# Altium schematic sheet MCU_main.SchDoc
size A4; SheetNumber: 4; SheetTotal: 5
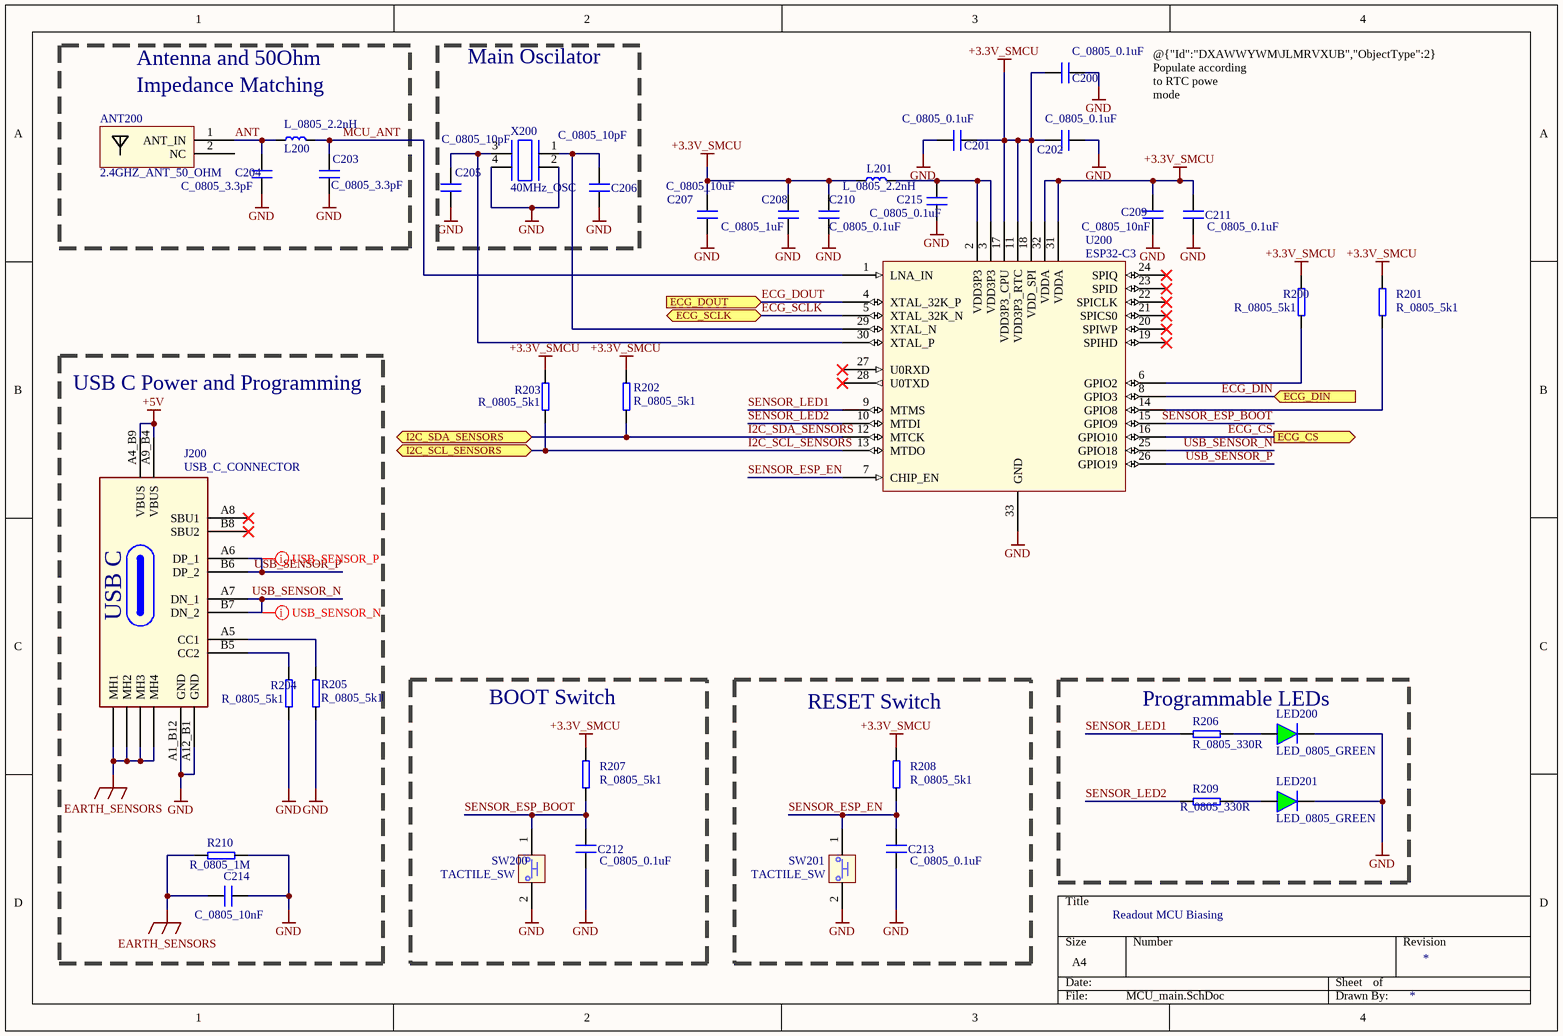
[diagram p0: MCU_main.SchDoc]

## Parts
ANT200  2.4GHZ_ANT_50_OHM  [Chip2PinSM127P600-8N]
C200  C_0805_0.1uF  [CAP_0805]
C201  C_0805_0.1uF  [CAP_0805]
C202  C_0805_0.1uF  [CAP_0805]
C203  C_0805_3.3pF  [CAP_0805]
C204  C_0805_3.3pF  [CAP_0805]
C205  C_0805_10pF  [CAP_0805]
C206  C_0805_10pF  [CAP_0805]
C207  C_0805_10uF  [CAP_0805]
C208  C_0805_1uF  [CAP_0805]
C209  C_0805_10nF  [CAP_0805]
C210  C_0805_0.1uF  [CAP_0805]
C211  C_0805_0.1uF  [CAP_0805]
C212  C_0805_0.1uF  [CAP_0805]
C213  C_0805_0.1uF  [CAP_0805]
C214  C_0805_10nF  [CAP_0805]
C215  C_0805_0.1uF  [CAP_0805]
J200  USB_C_CONNECTOR  [USB_C_CONNECTOR-Footprint-1]
L200  L_0805_2.2nH  [L_0805]
L201  L_0805_2.2nH  [L_0805]
LED200  LED_0805_GREEN  [LED_0806]
LED201  LED_0805_GREEN  [LED_0806]
R200  R_0805_5k1  [0805_RES]
R201  R_0805_5k1  [0805_RES]
R202  R_0805_5k1  [0805_RES]
R203  R_0805_5k1  [0805_RES]
R204  R_0805_5k1  [0805_RES]
R205  R_0805_5k1  [0805_RES]
R206  R_0805_330R  [0805_RES]
R207  R_0805_5k1  [0805_RES]
R208  R_0805_5k1  [0805_RES]
R209  R_0805_330R  [0805_RES]
R210  R_0805_1M  [0805_RES]
SW200  TACTILE_SW  [TACTILE_SW-Footprint-1]
SW201  TACTILE_SW  [TACTILE_SW-Footprint-1]
U200  ESP32-C3  [QFN127P600-8N]
X200  40MHz_OSC  [40MHz_OSC-Footprint-1]

## Blocks framed on the sheet
Main Oscilator: C205 C206 X200
USB C Power and Programming: C214 J200 R204 R205 R210
BOOT Switch: C212 R207 SW200
RESET Switch: C213 R208 SW201
Programmable LEDs: LED200 LED201 R206 R209

## Ports
ECG_CS (out, see Sensors_Power_Characterisation_Board[2B], Sensors[3D]), ECG_DIN (in, see Sensors_Power_Characterisation_Board[2B], Sensors[3D]), ECG_DOUT (in, see Sensors_Power_Characterisation_Board[2B], Sensors[3D]), ECG_SCLK (bidir, see Sensors_Power_Characterisation_Board[2B], Sensors[3D]), I2C_SCL_SENSORS (bidir, see Sensors_Power_Characterisation_Board[2B]), I2C_SDA_SENSORS (bidir, see Sensors_Power_Characterisation_Board[2B])

## Nets
+3.3V_SMCU: C200.1 C201.2 C202.1 C207.2 C208.2 C209.2 C210.1 C211.2 L201.1 R200.1 R201.1 R202.1 R203.1 R207.1 R208.1 U200.11(VDD3P3_RTC) U200.17(VDD3P3_CPU) U200.18(VDD_SPI) U200.31(VDDA) U200.32(VDDA)
+5V: J200.A4_B9(VBUS) J200.A9_B4(VBUS)
EARTH_SENSORS: C214.1 J200.MH1 J200.MH2 J200.MH3 J200.MH4 R210.2
GND: C200.2 C201.1 C202.2 C203.1 C204.1 C205.1 C206.1 C207.1 C208.1 C209.1 C210.2 C211.1 C212.1 C213.1 C214.2 C215.2 J200.A1_B12(GND) J200.A12_B1(GND) LED200.1 LED201.1 R204.2 R205.2 R210.1 SW200.2 SW201.2 U200.33(GND) X200.2 X200.4
ANT: ANT200.1(ANT_IN) C204.2 L200.1
ECG_CS: U200.16(GPIO10) ; port ECG_CS
ECG_DIN: U200.8(GPIO3) ; port ECG_DIN
ECG_DOUT: U200.4(XTAL_32K_P) ; port ECG_DOUT
ECG_SCLK: U200.5(XTAL_32K_N) ; port ECG_SCLK
I2C_SCL_SENSORS: R203.2 U200.13(MTDO) ; port I2C_SCL_SENSORS
I2C_SDA_SENSORS: R202.2 U200.12(MTCK) ; port I2C_SDA_SENSORS
MCU_ANT: C203.2 L200.2 U200.1(LNA_IN)
SENSOR_ESP_BOOT: C212.2 R207.2 SW200.1 U200.15(GPIO9)
SENSOR_ESP_EN: C213.2 R208.2 SW201.1 U200.7(CHIP_EN)
SENSOR_LED1: R206.2 U200.9(MTMS)
SENSOR_LED2: R209.2 U200.10(MTDI)
USB_SENSOR_N: J200.A7(DN_1) J200.B7(DN_2) U200.25(GPIO18)
USB_SENSOR_P: J200.A6(DP_1) J200.B6(DP_2) U200.26(GPIO19)
NetC205_2: C205.2 U200.30(XTAL_P) X200.3
NetC206_2: C206.2 U200.29(XTAL_N) X200.1
NetC215_1: C215.1 L201.2 U200.2(VDD3P3) U200.3(VDD3P3)
NetJ200_A5: J200.A5(CC1) R205.1
NetJ200_B5: J200.B5(CC2) R204.1
NetLED200_2: LED200.2 R206.1
NetLED201_2: LED201.2 R209.1
NetR200_2: R200.2 U200.6(GPIO2)
NetR201_2: R201.2 U200.14(GPIO8)

Not connected (* = marked no-connect by the designer): ANT200 2(NC); J200 A8(SBU1)* B8(SBU2)*; U200 19(SPIHD)* 20(SPIWP)* 21(SPICS0)* 22(SPICLK)* 23(SPID)* 24(SPIQ)* 27(U0RXD)* 28(U0TXD)*

## Layout directives
differential pair: USB_SENSOR_N, USB_SENSOR_P

## Notes on the sheet
- Antenna and 50Ohm
- Impedance Matching
- @{"Id":"DXAWWYWM\JLMRVXUB","ObjectType":2}  Populate according to RTC powe mode configurations
- Readout MCU Biasing
- (in symbol CMP-00013-4) USB C

## Library data of the parts
ANT200 = CMP-00009-6: 2.4GHz Chip Antenna 50 Ohm Impedance ANT2012LL00R2400A; Order Code: 603-ANT2012LL00R2400; Distributor: Mouser
C200-C202 C210-C213 C215 = CMP-00002-3: JLC Part Number: C28233
C203 C204 = CMP-00010-2: 3.3pF Capaciror; JLC Part Number: C1811
C205 C206 = CMP-00016-3: JLC Part Number: C107107
C207 = CMP-00006-2: JLC Part Number: C15850
C208 = CMP-00004-3: JLC Part Number: C28323
C209 C214 = CMP-00012-2: JLC Part Number: C1710
J200 = CMP-00013-4: USB2.0, Type C, Top Mount, Ch 1.68MM, Dual Row SMT / Tap/rl; Order Code: 538-217179-0001; JLC Part Number: C2831450; Distributor: Mouser
L200 L201 = CMP-00011-3: Required a minimum current of 500mA and a resonant frequrency of at least 6GHz; JLC Part Number: C964055
LED200 LED201 = CMP-00020-3: LED, Green, SMD, 0805 [2012 Metric], 30 mA, 2 V, 570 nm; Order Code: 2322081; Distributor: Farnell; JLC Part Number: C2297
R200-R205 R207 R208 = CMP-00014-2: JLC Part Number: C27834
R206 R209 = CMP-00022-2: JLC Part Number: C17630
R210 = CMP-00037-3: JLC Part Number: C131391
SW200 SW201 = CMP-00017-2: Keypad Switch, 1 Switches, SPST, Momentary-tactile, 0.05A, 12VDC, 2.94N, Solder Terminal, Surface Mount-straight; JLC Part Number: C455280
U200 = CMP-00008-4: 33 pin ESP32_C3 Microcontroller; JLC Part Number: C2858491
X200 = CMP-00029-2: 40 MHZ Oscillator, 10pF load capacitance; JLC Part Number: C426988